# EAGLE schematic encoder_step2 (EAGLE 6.1)
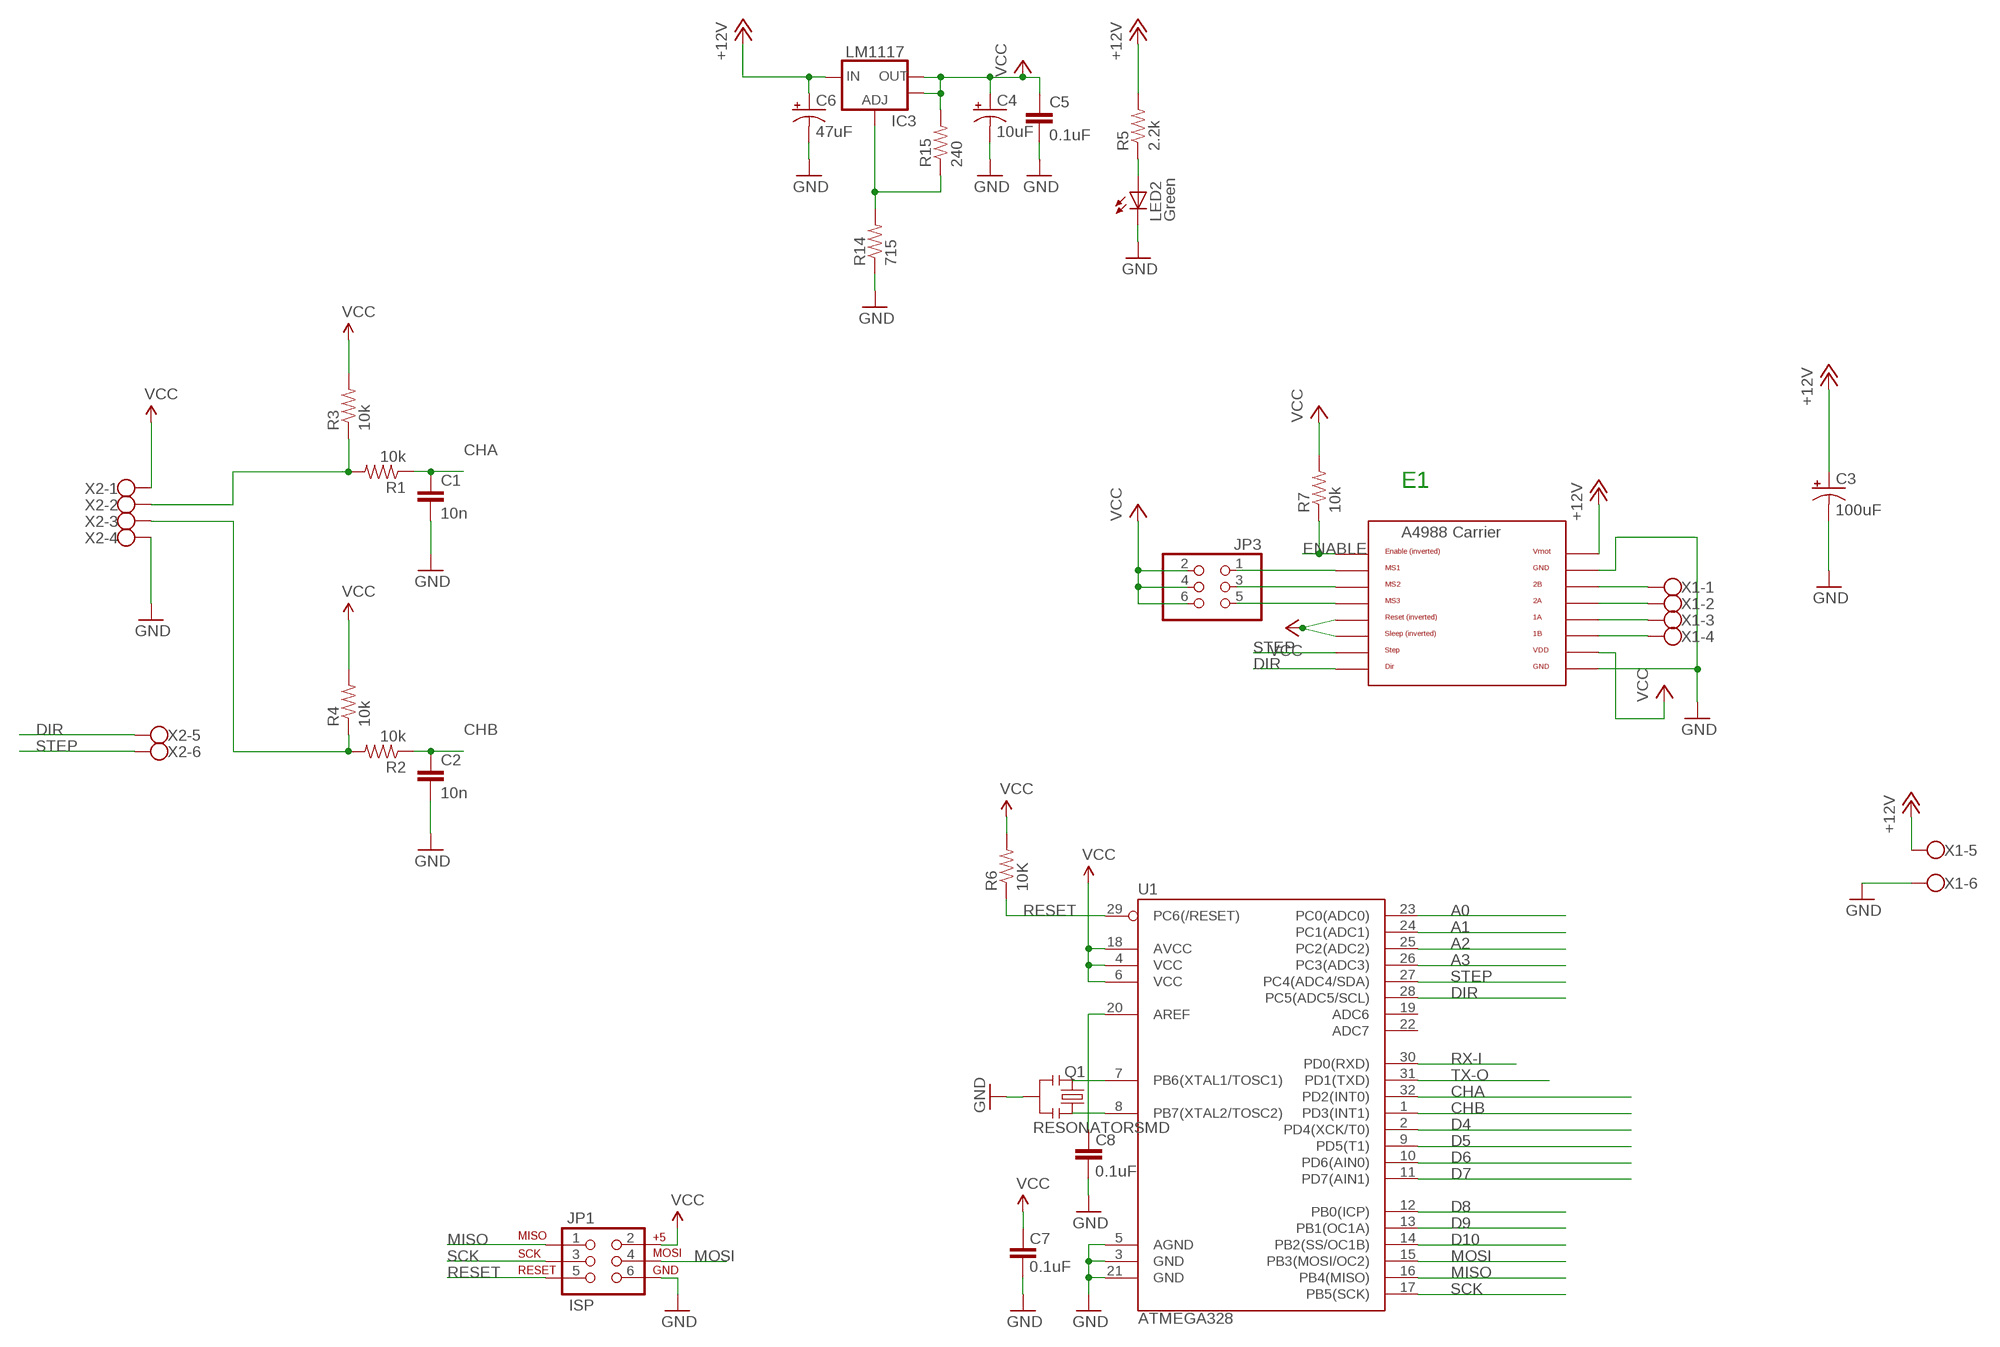
[diagram p0: schematic, sheet 1]

## Parts
C1  10n  2.2UF-25V-+80/-20(0805)  [0805]
C2  10n  2.2UF-25V-+80/-20(0805)  [0805]
C3  100uF  CPOL-US153CLV-0605  [153CLV-0605]
C4  10uF  CAP_POL1206  [EIA3216]
C5  0.1uF  CAP0805  [0805]
C6  47uF  CAP_POLD  [PANASONIC_D]
C7  0.1uF  CAP0805  [0805]
C8  0.1uF  CAP0805  [0805]
IC3  LM1117  V_REG_LM1117ALT1  [SOT223-ALT1]
JP1  ISP  AVR_SPI_PRG_6PTH  [2X3]
JP3  PINHD-2X3  [2X03]
LED2  Green  LED1206-NS  [LED-1206-NO_SILK]
Q1  RESONATORSMD  [RESONATOR-SMD]
R1  10k  RESISTOR0805-RES  [0805]
R2  10k  RESISTOR0805-RES  [0805]
R3  10k  RESISTOR0805-RES  [0805]
R4  10k  RESISTOR0805-RES  [0805]
R5  2.2k  RESISTOR0805-RES  [0805]
R6  10K  RESISTOR0805-RES  [0805]
R7  10k  RESISTOR0805-RES  [0805]
R14  715  RESISTOR0805-RES  [0805]
R15  240  RESISTOR0805-RES  [0805]
U1  ATMEGA328  ATMEGA168  [TQFP32-08]
U$5  A4988BREAKOUT  [A4988BREAKOUT]
X1  W237-6  [W237-6]
X2  W237-6  [W237-6]

## Nets
+12V [motors]: C3.+ C6.+ IC3.3(IN) R5.2 U$5.VMOT X1.5
A0: U1.23(PC0(ADC0))
A1: U1.24(PC1(ADC1))
A2: U1.25(PC2(ADC2))
A3: U1.26(PC3(ADC3))
AREF: C8.2 U1.20(AREF)
CHA: C1.1 R1.1 U1.32(PD2(INT0))
CHB: C2.1 R2.1 U1.1(PD3(INT1))
D4: U1.2(PD4(XCK/T0))
D5: U1.9(PD5(T1))
D6: U1.10(PD6(AIN0))
D7: U1.11(PD7(AIN1))
D8: U1.12(PB0(ICP))
D9: U1.13(PB1(OC1A))
D10: U1.14(PB2(SS/OC1B))
DIR: U1.28(PC5(ADC5/SCL)) U$5.DIR X2.5
ENABLE: R7.1 U$5.EN
GND: C1.2 C2.2 C3.- C4.C(-) C5.2 C6.- C7.1 C8.1 JP1.6 LED2.C Q1.2 R14.1 U1.3(GND) U1.5(AGND) U1.21(GND) U$5.GND U$5.GND@0(GND) X1.6 X2.4
MISO: JP1.1 U1.16(PB4(MISO))
MOSI: JP1.4 U1.15(PB3(MOSI/OC2))
N$1: Q1.1 U1.8(PB7(XTAL2/TOSC2))
N$2: LED2.A R5.1
N$3: R1.2 R3.1 X2.2
N$4: R2.2 R4.1 X2.3
N$5: Q1.3 U1.7(PB6(XTAL1/TOSC1))
N$12 [motors]: U$5.2B X1.1
N$13 [motors]: U$5.2A X1.2
N$15: IC3.1(ADJ) R14.2 R15.1
N$16 [motors]: U$5.1A X1.3
N$18 [motors]: U$5.1B X1.4
N$25: JP3.1 U$5.MS1
N$34: JP3.5 U$5.MS3
N$35: JP3.3 U$5.MS2
RESET: JP1.5 R6.1 U1.29(PC6(/RESET))
RX-I: U1.30(PD0(RXD))
SCK: JP1.3 U1.17(PB5(SCK))
STEP: U1.27(PC4(ADC4/SDA)) U$5.STEP X2.6
TX-O: U1.31(PD1(TXD))
VCC: C4.A(+) C5.1 C7.2 IC3.2(OUT) IC3.4(OUT) JP1.2 JP3.2 JP3.4 JP3.6 R3.2 R4.2 R6.2 R7.2 R15.2 U1.4(VCC) U1.6(VCC) U1.18(AVCC) U$5.RST U$5.SLP(SLEEP) U$5.VDD X2.1
Unconnected: U1.19(ADC6) U1.22(ADC7)

## Notes on the sheet
- E1

## Library data of the parts
C1 C2 = SparkFun-Capacitors:2.2UF-25V-+80/-20(0805): CAP-11624; PROD_ID: CAP-11624; VALUE: 2.2uF
C3 = adafruit:CPOL-US: POLARIZED CAPACITOR, American symbol
C4 C6 = SparkFun:CAP_POL: Capacitor Polarized These are standard SMD and PTH capacitors. Normally 10uF, 47uF, and 100uF in electrolytic and tantalum varieties. Always verify the external diameter of the through hole cap, it varies with capacity, voltage, and manufacturer. The EIA devices should be standard.
C5 C7 C8 = SparkFun:CAP: Capacitor Standard 0603 ceramic capacitor, and 0.1" leaded capacitor.
IC3 = Testing:V_REG_LM1117: Voltage Regulator LM1117 Standard adjustable voltage regulator but in SMD form. Spark Fun Electronics SKU : COM-00595
JP1 = SparkFun:AVR_SPI_PRG_6: AVR ISP 6 Pin This is the reduced ISP connector for AVR programming. Common on Arduino. This footprint will take up less PCB space and can be used with a 10-pin to 6-pin adapter such as SKU: BOB-08508
JP3 = pinhead:PINHD-2X3: PIN HEADER
LED2 = SparkFun-LED:LED: LEDs Standard schematic elements and footprints for 5mm, 3mm, 1206, and 0603 sized LEDs. 5mm - Spark Fun Electronics SKU : COM-00529 (and others)
Q1 = SparkFun:RESONATOR: Resonator Small SMD resonator. This is the itty bitty 10/20MHz resonators with built in caps. CSTCE10M0G55 and CSTCE20M0V53. Footprint has been reviewed closely but hasn't been tested yet.
R1-R4 R7 = SparkFun-Passives:RESISTOR: Resistor Basic schematic elements and footprints for 0603, 1206, and PTH resistors.
R5 R6 R14 R15 = SparkFun:RESISTOR: Resistor Basic schematic elements and footprints for 0603, 1206, and PTH resistors.
U1 = SparkFun:ATMEGA168
U$5 = RepRapjr:A4988BREAKOUT
X1 X2 = con-wago-500:W237-6: WAGO SCREW CLAMP; OC_FARNELL: unknown; OC_NEWARK: unknown

## Net classes
0 default: width 0.152 mm, drill 0.305 mm, clearance 0.152 mm
1 vcc: width 0.254 mm
2 motors: width 1.016 mm